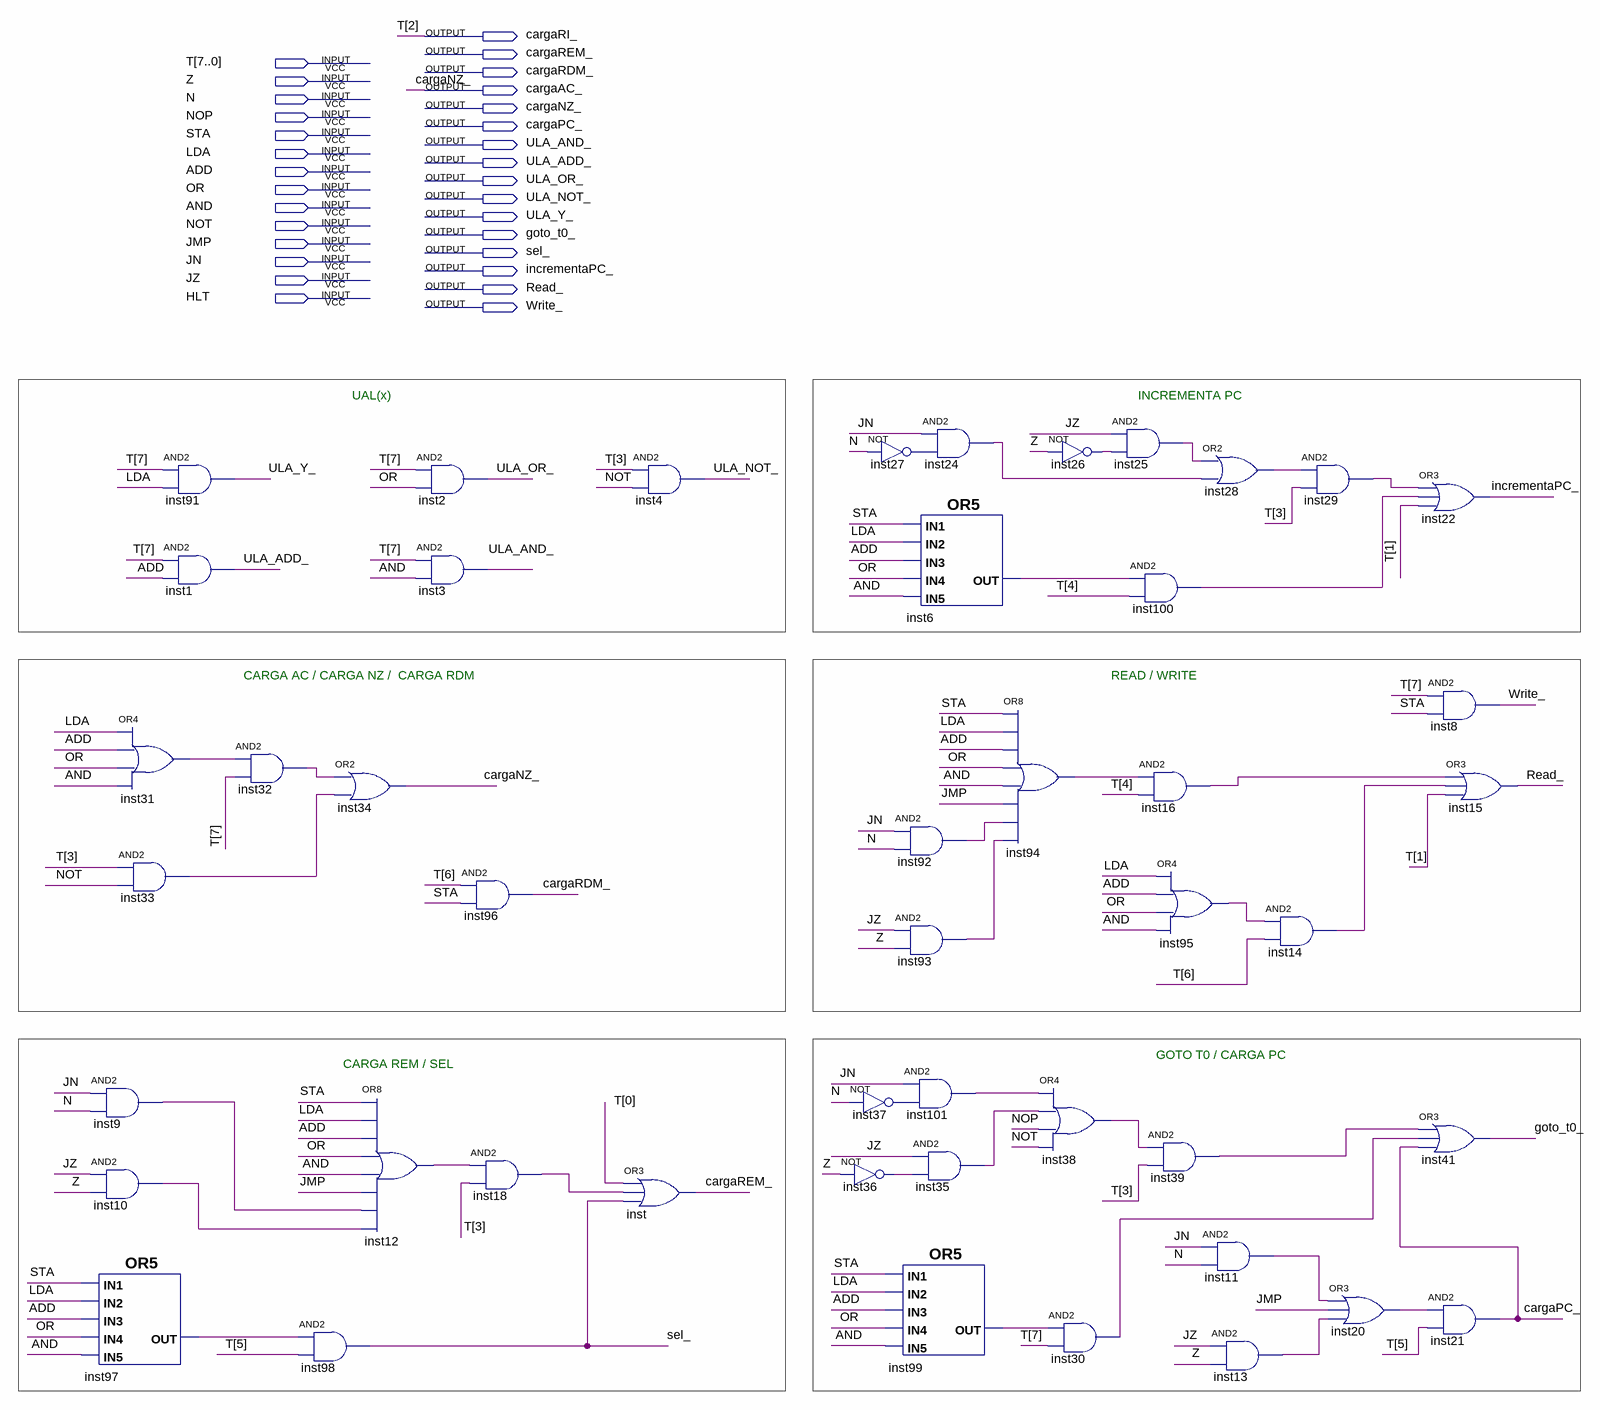
[diagram p0: schematic sheet]
// Quartus schematic UnidadeDeControle.bdf as structural Verilog: 47 symbols, 30 pins
module UnidadeDeControle (
  input  [7:0] T,
  input  Z,
  input  N,
  input  NOP,
  input  STA,
  input  LDA,
  input  ADD,
  input  OR,
  input  AND,
  input  NOT,
  input  JMP,
  input  JN,
  input  JZ,
  input  HLT,
  output cargaRI_,
  output cargaREM_,
  output cargaRDM_,
  output cargaAC_,
  output cargaNZ_,
  output cargaPC_,
  output ULA_AND_,
  output ULA_ADD_,
  output ULA_OR_,
  output ULA_NOT_,
  output ULA_Y_,
  output goto_t0_,
  output sel_,
  output incrementaPC_,
  output Read_,
  output Write_
);

  wire inst6_out, inst9_out, inst10_out, inst11_out, inst12_out, inst13_out, inst14_out, inst16_out,
       inst18_out, inst20_out, inst24_out, inst25_out, inst26_out, inst27_out, inst28_out, inst29_out,
       inst30_out, inst31_out, inst32_out, inst33_out, inst35_out, inst36_out, inst37_out, inst38_out,
       inst39_out, inst92_out, inst93_out, inst94_out, inst95_out, inst97_out, inst99_out, inst100_out,
       inst101_out;

  or inst31 (inst31_out, LDA, ADD, OR, AND);
  and inst33 (inst33_out, T[3], NOT);
  and inst9 (inst9_out, JN, N);
  and inst10 (inst10_out, JZ, Z);
  or inst97 (inst97_out, STA, LDA, ADD, OR, AND);
  and inst91 (ULA_Y_, T[7], LDA);
  and inst1 (ULA_ADD_, T[7], ADD);
  and inst32 (inst32_out, inst31_out, T[7]);
  or inst34 (cargaAC_, inst32_out, inst33_out);
  or inst12 (inst12_out, STA, LDA, ADD, OR, AND, JMP, inst9_out, inst10_out);
  and inst98 (sel_, inst97_out, T[5]);
  and inst2 (ULA_OR_, T[7], OR);
  and inst3 (ULA_AND_, T[7], AND);
  and inst96 (cargaRDM_, T[6], STA);
  and inst18 (inst18_out, inst12_out, T[3]);
  and inst4 (ULA_NOT_, T[3], NOT);
  or inst (cargaREM_, T[0], inst18_out, sel_);
  not inst27 (inst27_out, N);
  not inst37 (inst37_out, N);
  not inst36 (inst36_out, Z);
  and inst24 (inst24_out, JN, inst27_out);
  or inst6 (inst6_out, STA, LDA, ADD, OR, AND);
  and inst92 (inst92_out, JN, N);
  and inst93 (inst93_out, JZ, Z);
  and inst101 (inst101_out, JN, inst37_out);
  and inst35 (inst35_out, JZ, inst36_out);
  or inst99 (inst99_out, STA, LDA, ADD, OR, AND);
  or inst94 (inst94_out, STA, LDA, ADD, OR, AND, JMP, inst92_out, inst93_out);
  not inst26 (inst26_out, Z);
  or inst38 (inst38_out, inst101_out, inst35_out, NOP, NOT);
  and inst30 (inst30_out, inst99_out, T[7]);
  and inst25 (inst25_out, JZ, inst26_out);
  and inst100 (inst100_out, inst6_out, T[4]);
  and inst16 (inst16_out, inst94_out, T[4]);
  or inst95 (inst95_out, LDA, ADD, OR, AND);
  and inst39 (inst39_out, inst38_out, T[3]);
  or inst28 (inst28_out, inst25_out, inst24_out);
  and inst11 (inst11_out, JN, N);
  and inst13 (inst13_out, JZ, Z);
  and inst29 (inst29_out, inst28_out, T[3]);
  and inst14 (inst14_out, inst95_out, T[6]);
  or inst20 (inst20_out, inst11_out, JMP, inst13_out);
  or inst22 (incrementaPC_, inst29_out, inst100_out, T[1]);
  and inst8 (Write_, T[7], STA);
  or inst15 (Read_, inst16_out, inst14_out, T[1]);
  or inst41 (goto_t0_, inst39_out, inst30_out, cargaPC_);
  and inst21 (cargaPC_, inst20_out, T[5]);

  assign cargaNZ_ = cargaAC_;
  assign cargaRI_ = T[2];

  // Notes on the sheet:
  //   UAL(x)
  //   INCREMENTA PC
  //   CARGA AC / CARGA NZ /  CARGA RDM
  //   READ / WRITE
  //   GOTO T0 / CARGA PC
  //   CARGA REM / SEL
endmodule
